# Altium schematic sheet color Sensor_Schematic.schdoc
size 298 x 209 mm
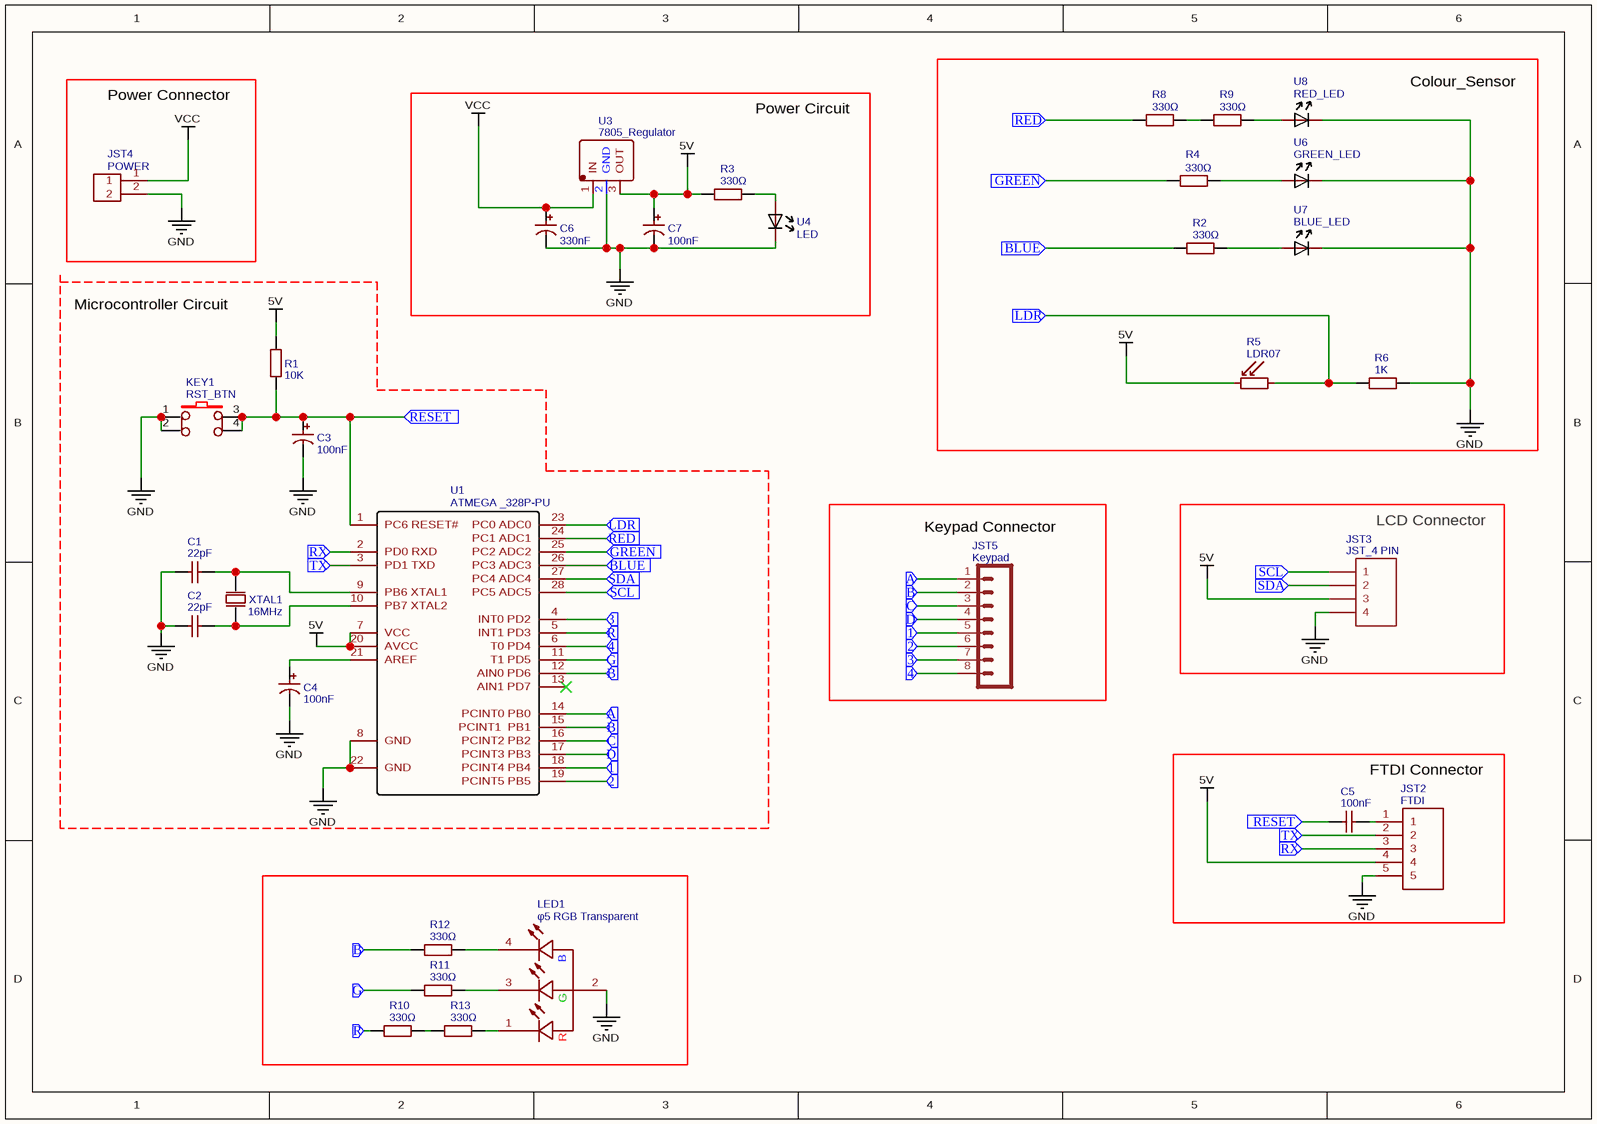
[diagram p0: color Sensor_Schematic.schdoc]

## Parts
C1  22pF  [CAP-TH_L3.5-W3.0-P2.54-D0.8]
C2  22pF  [CAP-TH_L3.5-W3.0-P2.54-D0.8]
C3  100nF  [CAP-TH_BD5.0-P2.00-D0.8-FD]
C4  100nF  [CAP-TH_BD5.0-P2.00-D0.8-FD]
C5  100nF  [RAD-0.2]
C6  330nF  [CAP-TH_BD5.0-P2.00-D0.8-FD]
C7  100nF  [CAP-TH_BD5.0-P2.00-D0.8-FD]
JST2  FTDI  [JST 2.54MM MALE 5 PIN CONNECTOR]
JST3  JST_4 PIN  [JST_XH_4_PIN_TOP_ENTRY]
JST4  POWER  [CONN-TH_XHB-2A]
JST5  Keypad  [1X08-1.25MM_JST]
KEY1  RST_BTN  [KEY-TH_4P-L6.0-W6.0-P4.50]
LED1  φ5 RGB Transparent  [LED-TH_4P-BD5.8-P1.30]
R1  10K  [AXIAL-0.4]
R2  330Ω  [AXIAL-0.4]
R3  330Ω  [AXIAL-0.4]
R4  330Ω  [AXIAL-0.4]
R5  LDR07  [RESISTOR_LDR_5.1X4.3_RM3.4]
R6  1K  [AXIAL-0.4]
R8  330Ω  [AXIAL-0.4]
R9  330Ω  [AXIAL-0.4]
R10  330Ω  [AXIAL-0.4]
R11  330Ω  [AXIAL-0.4]
R12  330Ω  [AXIAL-0.4]
R13  330Ω  [AXIAL-0.4]
U1  ATMEGA _328P-PU  [DIP-28_L34.6-W7.3-P2.54-LS10.2-BL]
U3  7805_Regulator  [TO-220-3_L10.0-W4.5-P2.54-L]
U4  LED  [5MM LED]
U6  GREEN_LED  [5MM LED]
U7  BLUE_LED  [5MM LED]
U8  RED_LED  [5MM LED]
XTAL1  16MHz  [16MHZ_OSC [PCB]]

## Blocks framed on the sheet
Colour_Sensor: R2 R4-R6 R8 R9 U6-U8
Power Connector: JST4
Power Circuit: C6 C7 R3 U3 U4
Keypad Connector: JST5
LCD Connector: JST3
FTDI Connector: C5 JST2

## Ports
1 (in), 2 (in), 3 (in), 4 (in), A (in), B (in), BLUE (in), C (in), D (in), G (in), GREEN (in), LDR (in), R (in), RED (in), RESET (in), RX (in), SCL (in), SDA (in), TX (in)

## Nets
5V: C7.1 JST2.4 JST3.3 R1.2 R3.1 R5.2 U1.7(VCC) U1.20(AVCC) U3.3(OUT)
GND: C1.1 C2.1 C3.2 C4.2 C6.2 C7.2 JST2.5 JST3.4 JST4.2 KEY1.1 KEY1.2 LED1.2(CA) R6.2 U1.8(GND) U1.22(GND) U3.2(GND) U4.2 U6.2 U7.2 U8.2
VCC: C6.1 JST4.1 U3.1(IN)
1: JST5.5 U1.18(PCINT4_PB4) ; port 1
2: JST5.6 U1.19(PCINT5_PB5) ; port 2
3: JST5.7 U1.4(INT0_PD2) ; port 3
4: JST5.8 U1.6(T0_PD4) ; port 4
A: JST5.1 U1.14(PCINT0_PB0) ; port A
B: JST5.2 R12.1 U1.12(AIN0_PD6) U1.15(PCINT1__PB1) ; port B
BLUE: R2.1 U1.26(PC3_ADC3) ; port BLUE
C: JST5.3 U1.16(PCINT2_PB2) ; port C
D: JST5.4 U1.17(PCINT3_PB3) ; port D
G: R11.1 U1.11(T1_PD5) ; port G
GREEN: R4.1 U1.25(PC2_ADC2) ; port GREEN
LDR: R5.1 R6.1 U1.23(PC0_ADC0) ; port LDR
R: R10.1 U1.5(INT1_PD3) ; port R
RED: R8.1 U1.24(PC1_ADC1) ; port RED
RESET: C3.1 C5.1 KEY1.3 KEY1.4 R1.1 U1.1(PC6_RESET#) ; port RESET
RX: JST2.3 U1.2(PD0_RXD) ; port RX
SCL: JST3.1 U1.28(PC5_ADC5) ; port SCL
SDA: JST3.2 U1.27(PC4_ADC4) ; port SDA
TX: JST2.2 U1.3(PD1_TXD) ; port TX
NetC1_2: C1.2 U1.9(PB6_XTAL1) XTAL1.1(OSC1)
NetC2_2: C2.2 U1.10(PB7_XTAL2) XTAL1.2(OSC2)
NetC4_1: C4.1 U1.21(AREF)
NetC5_2: C5.2 JST2.1
NetLED1_1: LED1.1(KR) R13.2
NetLED1_3: LED1.3(KG) R11.2
NetLED1_4: LED1.4(KB) R12.2
NetR2_2: R2.2 U7.1
NetR3_2: R3.2 U4.1
NetR4_2: R4.2 U6.1
NetR8_2: R8.2 R9.1
NetR9_2: R9.2 U8.1
NetR10_2: R10.2 R13.1

Not connected (* = marked no-connect by the designer): U1 13(AIN1_PD7)*

## Notes on the sheet
- (near R1) Microcontroller Circuit
- (in symbol φ5 RGB Transparent) B; G; R

## Library data of the parts
C1 C2 = 22pF: BOM_Manufacturer: ReliaPro; BOM_Manufacturer Part: 22pf/50V 10%; nameAlias: Capacitance; BOM_Supplier: LCSC; BOM_Supplier Part: C9316; spicePre: C; spiceSymbolName: 22pF
C3 C4 C7 = 100nF: BOM_Manufacturer: ValuePro; BOM_Manufacturer Part: 0.1UF 50V; nameAlias: Capacitance; BOM_Supplier: LCSC; BOM_Supplier Part: C28061; BOM_JLCPCB Part Class: Extended Part; spicePre: C; spiceSymbolName: 0.1uF
C5 = 100nF: BOM_Manufacturer: LCSC; BOM_Manufacturer Part: 0.1UF(104) +-20% 63v; Value: 100nF; BOM_Supplier: LCSC; BOM_Supplier Part: C19355; spicePre: C; spiceSymbolName: 100nF
C6 = 330nF: BOM_Manufacturer: ValuePro; BOM_Manufacturer Part: 0.33uF 50V 5*11; nameAlias: Capacitance; BOM_Supplier: LCSC; BOM_Supplier Part: C45097; BOM_JLCPCB Part Class: Extended Part; spicePre: C; spiceSymbolName: 0.33uF
JST2 = FTDI: Contributor: MagnusInc; spicePre: U; spiceSymbolName: JST_5 PIN
JST3 = JST_4 PIN: Contributor: fabiano.riccardi; spicePre: J; spiceSymbolName: JST_4 PIN
JST4 = POWER: BOM_Manufacturer: BOOMELE; BOM_Manufacturer Part: XHB-2A Connector; BOM_Supplier: LCSC; image: //image.lceda.cn/szlcsc/C57981.jpg; BOM_Supplier Part: C57981; BOM_JLCPCB Part Class: Extended Part; spicePre: C; spiceSymbolName: JST_2 PIN
JST5 = Keypad: description: Header 4; Contributor: Vlad Tarabega; spicePre: J; spiceSymbolName: Micro JST 8-Pin Male PCB Connector 1.25mm
KEY1 = RST_BTN: BOM_Manufacturer: ReliaPro; BOM_Manufacturer Part: button6*6*8.5; BOM_Supplier Part: C59980; BOM_Supplier: LCSC; image: http://image.lceda.cn/szlcsc/C59980.jpg; spicePre: K; spiceSymbolName: Push_Button
LED1 = φ5 RGB Transparent: BOM_Manufacturer: KENTO; BOM_Manufacturer Part: φ5 RGB Transparent LED; Contributor: LCSC; BOM_Supplier: LCSC; BOM_Supplier Part: C32985; spicePre: L; spiceSymbolName: φ5 RGB Transparent
R1 = 10K: BOM_Manufacturer: UniOhm; BOM_Manufacturer Part: MFR0W4F2200A50; Power: 1/4W; Tolerance: ±1%; BOM_EasyEDA: E57439; Value: Value; BOM_Supplier Part: E57439; BOM_Supplier: EasyEDA; spicePre: R; spiceSymbolName: RESISTOR
R2-R4 R8-R13 = 330Ω: BOM_Manufacturer: UniOhm; BOM_Manufacturer Part: MFR0W4F2200A50; Power: 1/4W; Tolerance: ±1%; BOM_EasyEDA: E57439; Value: Value; BOM_Supplier Part: E57439; BOM_Supplier: EasyEDA; spicePre: R; spiceSymbolName: RESISTOR
R5 = LDR07: Contributor: KiCAD; license: https://www.gnu.org/licenses/lgpl-2.1.html; spicePre: R; spiceSymbolName: LDR07
R6 = 1K: BOM_Manufacturer: UniOhm; BOM_Manufacturer Part: MFR0W4F2200A50; Power: 1/4W; Tolerance: ±1%; BOM_EasyEDA: E57439; Value: Value; BOM_Supplier Part: E57439; BOM_Supplier: EasyEDA; spicePre: R; spiceSymbolName: RESISTOR
U1 = ATMEGA _328P-PU: BOM_Manufacturer: MICROCHIP; BOM_Manufacturer Part: ATMEGA328P-PU; sourceId: Oic6oiASL; Contributor: LCSC; timeStamp: 1451725987; BOM_Supplier: LCSC; image: //image.lceda.cn/szlcsc/C33901.jpg; BOM_Supplier Part: C33901; spicePre: U; spiceSymbolName: ATMEGA _328P-PU
U3 = 7805_Regulator: BOM_Manufacturer: Foshan Blue Rocket Elec; BOM_Manufacturer Part: 7805; Contributor: LCSC; BOM_Supplier: LCSC; BOM_Supplier Part: C305416; BOM_JLCPCB Part Class: Extended Part; spicePre: U; spiceSymbolName: 7805_Regulator
U4 = LED: Contributor: Axbri; BOM_Manufacturer Part: 5mm LED; spicePre: U; spiceSymbolName: LED
U6 = GREEN_LED: Contributor: Axbri; BOM_Manufacturer Part: 5mm LED; spicePre: U; spiceSymbolName: LED
U7 = BLUE_LED: Contributor: Axbri; BOM_Manufacturer Part: 5mm LED; spicePre: U; spiceSymbolName: LED
U8 = RED_LED: Contributor: Axbri; BOM_Manufacturer Part: 5mm LED; spicePre: U; spiceSymbolName: LED
XTAL1 = 16MHz: BOM_Manufacturer: SHIVRAM; BOM_Manufacturer Part: 0SC-16MHz; nameAlias: Frequency; Contributor: Mantas Petrauskas; BOM_Supplier: SHIVRAM; BOM_Supplier Part: 0SC-16MHz; spicePre: X; spiceSymbolName: Crystal Oscillator